# Altium schematic sheet Bike_Gps_v1.SchDoc
size A4
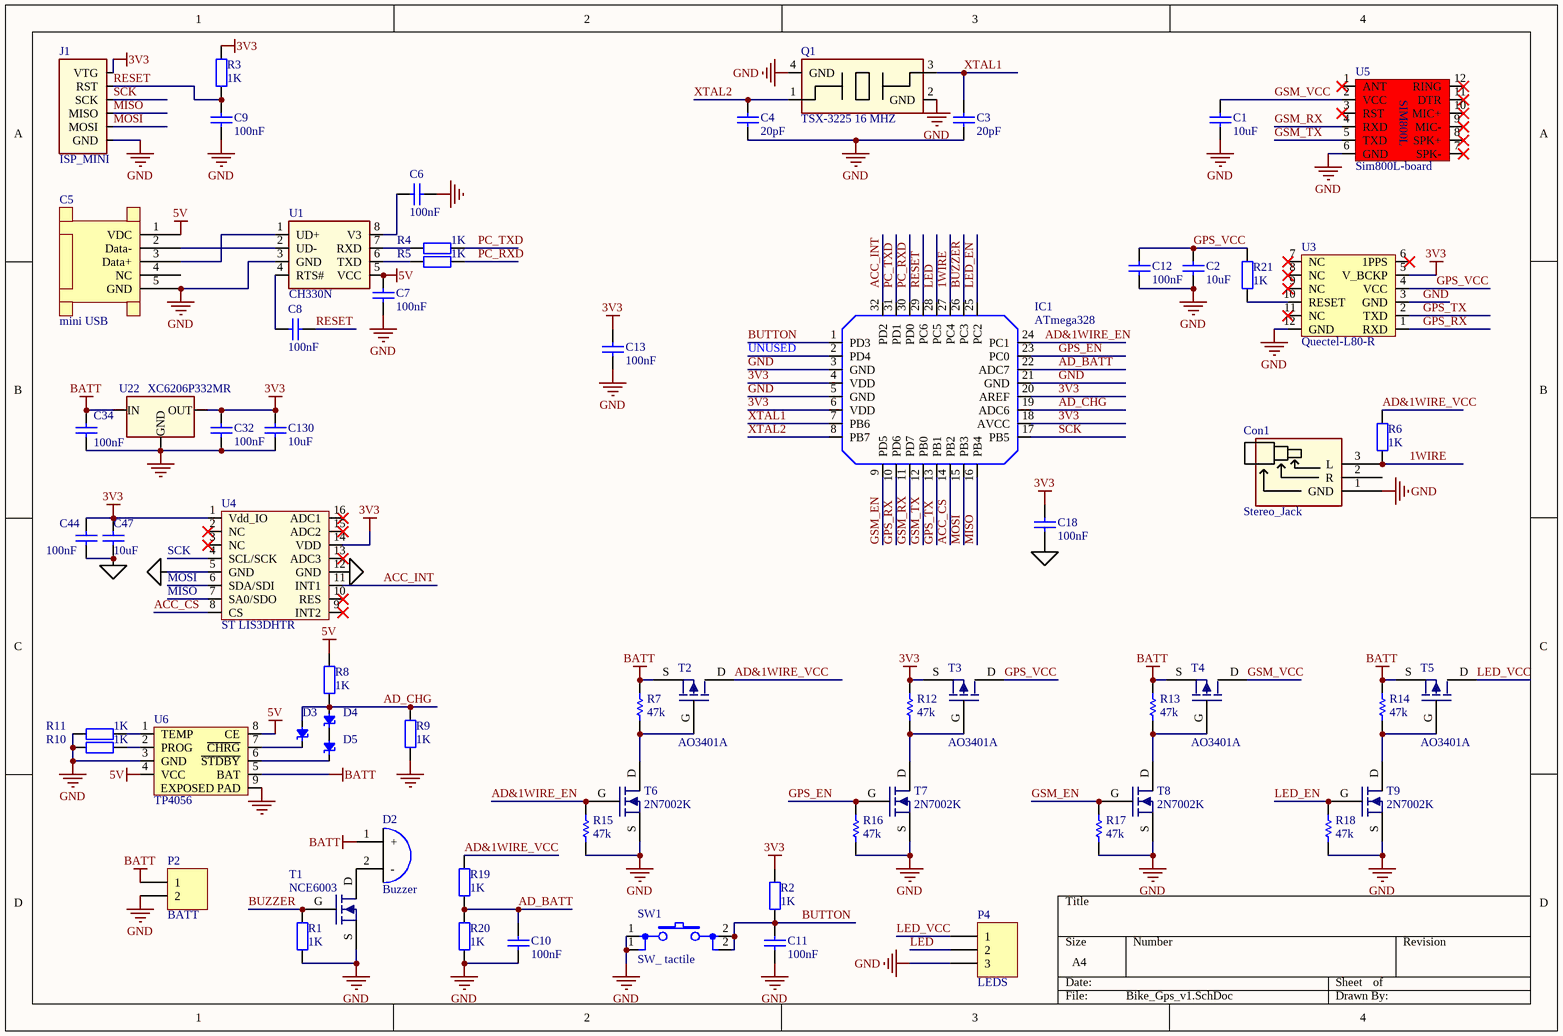
[diagram p0: Bike_Gps_v1.SchDoc]

## Parts
C1  10uF  [FP_1206_CAP_085]
C2  10uF  [FP_1206_CAP_085]
C3  20pF  [FP_0603_CAP_080]
C4  20pF  [FP_0603_CAP_080]
C5  mini USB  [USB/SM0.8-6H5]
C6  100nF  [FP_0603_CAP_080]
C7  100nF  [FP_0603_CAP_080]
C8  100nF  [FP_0603_CAP_080]
C9  100nF  [FP_0603_CAP_080]
C10  100nF  [FP_0603_CAP_080]
C11  100nF  [FP_0603_CAP_080]
C12  100nF  [FP_0603_CAP_080]
C13  100nF  [FP_0603_CAP_080]
C18  100nF  [FP_0603_CAP_080]
C32  100nF  [FP_0603_CAP_080]
C34  100nF  [FP_0603_CAP_080]
C44  100nF  [FP_0603_CAP_080]
C47  10uF  [FP_0805_CAP_085]
C130  10uF  [FP_0805_CAP_085]
Con1  Stereo_Jack  [STEREO_JACK]
D2  Buzzer  [Buzzer_MBS12XXX]
D3  5.6V Zener  [FP_SOD323]  (value not drawn)
D4  5.6V Zener  [FP_SOD323]  (value not drawn)
D5  5.6V Zener  [FP_SOD323]  (value not drawn)
IC1  ATmega328  [TQFP32_N]
J1  ISP_MINI  [AVR_ISP_MINI]  (no BOM)
P2  BATT  [HEADER_2.54MM_M_1x2]
P4  LEDS  [HEADER_2.54MM_M_1x3]
Q1  TSX-3225 16 MHZ  [FP_Cristal-3225]
R1  1K  [FP_0603_RES]
R2  1K  [FP_0603_RES]
R3  1K  [FP_0603_RES]
R4  1K  [FP_0603_RES]
R5  1K  [FP_0603_RES]
R6  1K  [FP_0603_RES]
R7  47k  [FP_0603_RES]
R8  1K  [FP_0603_RES]
R9  1K  [FP_0603_RES]
R10  1K  [FP_0603_RES]
R11  1K  [FP_0603_RES]
R12  47k  [FP_0603_RES]
R13  47k  [FP_0603_RES]
R14  47k  [FP_0603_RES]
R15  47k  [FP_0603_RES]
R16  47k  [FP_0603_RES]
R17  47k  [FP_0603_RES]
R18  47k  [FP_0603_RES]
R19  1K  [FP_0603_RES]
R20  1K  [FP_0603_RES]
R21  1K  [FP_0603_RES]
SW1  SW_ tactile  [BUTTON_6X6]
T1  NCE6003  [FET_SOT23]
T2  AO3401A  [FET_SOT23]
T3  AO3401A  [FET_SOT23]
T4  AO3401A  [FET_SOT23]
T5  AO3401A  [FET_SOT23]
T6  2N7002K  [FET_SOT23]
T7  2N7002K  [FET_SOT23]
T8  2N7002K  [FET_SOT23]
T9  2N7002K  [FET_SOT23]
U1  CH330N  [DIGITAL_SOIC8]
U3  Quectel-L80-R  [Quectel-L80-R]
U4  ST LIS3DHTR  [LGA 16 (3x3x1mm)]
U5  Sim800L-board  [Sim800L-board]
U6  TP4056  [Supply_SO8_PWP]
U22  XC6206P332MR  [SUPPLY_SOT23]

## Nets
3V3: C13.2 C18.2 C32.2 C44.2 C47.1 C130.1 IC1.4(VDD) IC1.6(VDD) IC1.18(AVCC) IC1.20(AREF) J1.1(VTG) R2.1 R3.2 R12.2 T3.S U3.5(V_BCKP) U4.1(Vdd_IO) U4.14(VDD) U22.VOUT(OUT)
5V: C5.1(VDC) C7.1 R8.1 U1.5(VCC) U6.4(VCC) U6.8(CE)
BATT: C34.2 D2.1(+) P2.1 R7.2 R13.2 R14.2 T2.S T4.S T5.S U6.5(BAT) U22.VIN(IN)
GND: C1.2 C2.1 C3.1 C4.1 C5.5(GND) C6.1 C7.2 C9.2 C10.1 C11.1 C12.1 C13.1 C18.1 C32.1 C34.1 C44.1 C47.2 C130.2 Con1.1(GND) IC1.3(GND) IC1.5(GND) IC1.21(GND) J1.6(GND) P2.2 P4.3 Q1.2(GND) Q1.4(GND) R1.2 R9.2 R10.1 R11.1 R15.1 R16.1 R17.1 R18.1 R20.1 SW1.1 T1.S T6.S T7.S T8.S T9.S U1.3(GND) U3.3(GND) U3.12(GND) U4.5(GND) U4.12(GND) U5.6(GND) U6.3(GND) U6.9(EXPOSED_PAD) U22.GND
1WIRE: Con1.3(L) IC1.27(PC4) R6.2
ACC_CS: IC1.14(PB2) U4.8(CS)
ACC_INT: IC1.32(PD2) U4.11(INT1)
AD&1WIRE_EN: IC1.24(PC1) R15.2 T6.G
AD&1WIRE_VCC: R6.1 R19.2 T2.D
AD_BATT: C10.2 IC1.22(ADC7) R19.1 R20.2
AD_CHG: D3.A D4.A IC1.19(ADC6) R8.2 R9.1
BUTTON: C11.2 IC1.1(PD3) R2.2 SW1.2
BUZZER: IC1.26(PC3) R1.1 T1.G
GPS_EN: IC1.23(PC0) R16.2 T7.G
GPS_RX: IC1.10(PD6) U3.1(RXD)
GPS_TX: IC1.13(PB1) U3.2(TXD)
GPS_VCC: C2.2 C12.2 R21.1 T3.D U3.4(VCC)
GSM_EN: IC1.9(PD5) R17.2 T8.G
GSM_RX: IC1.11(PD7) U5.4(RXD)
GSM_TX: IC1.12(PB0) U5.5(TXD)
GSM_VCC: C1.1 T4.D U5.2(VCC)
LED: IC1.28(PC5) P4.2
LED_EN: IC1.25(PC2) R18.2 T9.G
LED_VCC: P4.1 T5.D
MISO: IC1.16(PB4) J1.4(MISO) U4.7(SA0/SDO)
MOSI: IC1.15(PB3) J1.5(MOSI) U4.6(SDA/SDI)
PC_RXD: IC1.30(PD0) R5.2
PC_TXD: IC1.31(PD1) R4.2
RESET: C8.1 C9.1 IC1.29(PC6) J1.2(RST) R3.1
SCK: IC1.17(PB5) J1.3(SCK) U4.4(SCL/SCK)
UNUSED: IC1.2(PD4)
XTAL1: C3.2 IC1.7(PB6) Q1.3
XTAL2: C4.2 IC1.8(PB7) Q1.1
NetC5_2: C5.2(Data-) U1.2(UD-)
NetC5_3: C5.3(Data+) U1.1(UD+)
NetC6_2: C6.2 U1.8(V3)
NetC8_2: C8.2 U1.4(RTS#)
NetD2_2: D2.2(-) T1.D
NetD3_K: D3.K U6.7(~{CHRG})
NetD4_K: D4.K D5.A
NetD5_K: D5.K U6.6(~{STDBY})
NetR4_1: R4.1 U1.7(RXD)
NetR5_1: R5.1 U1.6(TXD)
NetR7_1: R7.1 T2.G T6.D
NetR10_2: R10.2 U6.2(PROG)
NetR11_2: R11.2 U6.1(TEMP)
NetR12_1: R12.1 T3.G T7.D
NetR13_1: R13.1 T4.G T8.D
NetR14_1: R14.1 T5.G T9.D
NetR21_2: R21.2 U3.10(RESET)

Not connected (* = marked no-connect by the designer): C5 4(NC); Con1 2(R); U3 6(1PPS)* 7(NC)* 8(NC)* 9(NC)* 11(NC)*; U4 2(NC)* 3(NC)* 9(INT2)* 10(RES)* 13(ADC3)* 15(ADC2)* 16(ADC1)*; U5 1(ANT)* 3(RST)* 7(SPK-)* 8(SPK+)* 9(MIC-)* 10(MIC+)* 11(DTR)* 12(RING)*

## Notes on the sheet
- (in symbol Sim800L-board) SIM800L

## Library data of the parts
C1 C2 = Cap: Capacitor ceramic X7R; Value: 100nF; Order info: 82-08-03
C3 C4 = Cap: Capacitor; Part number: 20pF_0603_50V_NP0_5percent; Leírás: Capacitor ceramic NP0; Value: 20pF
C6-C13 C18 C32 C34 = Cap: Capacitor; Part number: 100nF_0603_50V_X7R_10percent; Leírás: Capacitor ceramic; Value: 100nF; Sample: 82-10-85
C44 = CAP: Capacitor; Part number: 100nF_0603_50V_X7R_10percent; Leírás: Capacitor ceramic; Value: 100nF; Sample: 82-10-85
C47 C130 = CAP: Capacitor; Part number: 10uF_0805_10V_X5R_10percent; Leírás: Capacitor ceramic; Value: 10uF; Sample: 82-08-17
D3-D5 = 5.6V Zener: 5.6V ±5% 300mW 1uA @ 2.5V SOD-323 Zener Diodes RoHS; Part number: MM3Z5V6; Sample: https://lcsc.com/product-detail/Zener-Diodes_ST-Semtech-MM3Z5V6_C48886.html
IC1 = ATmega328: Order info: TODO
P2 = Header 1X2: Header, 2-Pin
P4 = Header 1X3: Header, 3-Pin; LatestRevisionDate: 17-Jul-2002; LatestRevisionNote: Re-released for DXP Platform.; Publisher: Altium Limited
Q1 = TSX-3225 25 MHZ: CRYSTAL, TSX-3225, 16 MHZ, 9 PF; Order info: https://lcsc.com/product-detail/New-Arrivals_JGHC-S3216000201060_C426974.html
R1-R6 R8-R11 R19-R21 = RES: Resistor; Part number: 1k_0603_1percent; Value: 1K; Leírás: Resistor; Sample: 80-11-59
R7 R12-R18 = Res1: Resistor; Part number: 47k_0603_1percent; Value: 47k; Leírás: Resistor; Sample: 81-10-46
T1 = NMOS: N Channel 60V 3A 2V @ 250uA 105 mΩ @ 3A,10V 1.7W SOT-23(SOT-23-3) MOSFET RoHS; Leírás: N Channel 60V 3A 2V @ 250uA 105 mΩ @ 3A,10V 1.7W SOT-23(SOT-23-3) MOSFET RoHS; Part number: NCE6003; Sample: https://lcsc.com/product-detail/MOSFET_Wuxi-NCE-Power-Semiconductor-NCE6003_C112351.html
T2-T5 = PMOS: P Channel 30V 4.1A 1.3V @ 250uA 65 mΩ @ 4.2A,10V 350mW SOT-23 MOSFET RoHS; Part number: AO3401A; Sample: https://lcsc.com/product-detail/MOSFET_UMW-Youtai-Semiconductor-Co-Ltd-AO3401A_C347476.html
T6-T9 = NMOS: N-Channel MOSFET; Leírás: N-FET 60V 0.3A; Part number: 2N7002K; Sample: https://lcsc.com/product-detail/MOSFET_Guangdong-Hottech-2N7002K_C181083.html
U1 = CH330N: Transceiver USB 2.0 2Mbps SOP-8_150mil USB ICs RoHS; Order info: https://lcsc.com/product-detail/USB-ICs_WCH-Jiangsu-Qin-Heng-CH330N_C108996.html; Part number: CH330N
U3 = Quectel-L80-R: Quectel GPS module with embedded antenna
U4 = ST LIS3DHTR: ST LIS3DHTR 3 axis accelerometer; Leírás: Accelerometers MEMS Ultra Low-Power 3-Axes "Nano"; Part number: LIS3DHTR; Sample: http://www.mouser.in/ProductDetail/STMicroelectronics/LIS3DHTR/?qs=6la6oa3D8xzhXYax3cEo4w==
U5 = Sim800L-board: Sim800L devboard with nano sim slot
U6 = TP4056: 1A Li-on battery charger; part number: TP4056; Sample: https://lcsc.com/product-detail/PMIC-Battery-Management_TPOWER-TP4056_C382139.html
U22 = XC6206P332MR: Fixed 36V 5V 250mA SOT-23(SOT-23-3) Low Dropout Regulators(LDO) RoHS; Part number: XC6206P332MR; Sample: https://lcsc.com/product-detail/Low-Dropout-Regulators-LDO_XC6206P332MR_C5446.html
C5 = mini USB: Order info: 43-16-44
D2 = Buzzer: Part number: *; Sample: *